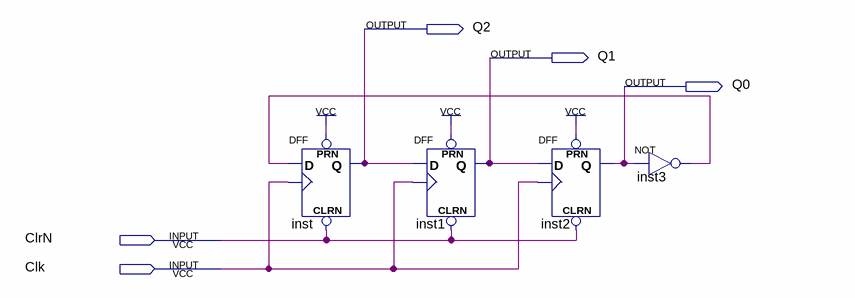
[diagram p0: schematic sheet]
// Quartus schematic Johnscounter.bdf as structural Verilog: 4 symbols, 5 pins
module Johnscounter (
  input  ClrN,
  input  Clk,
  output Q2,
  output Q1,
  output Q0
);

  wire inst3_out;

  DFF inst (.CLRN(ClrN), .CLK(Clk), .D(inst3_out), .PRN(1'b1), .Q(Q2));
  DFF inst1 (.CLRN(ClrN), .CLK(Clk), .D(Q2), .PRN(1'b1), .Q(Q1));
  DFF inst2 (.CLRN(ClrN), .CLK(Clk), .D(Q1), .PRN(1'b1), .Q(Q0));
  not inst3 (inst3_out, Q0);
endmodule
